# EAGLE design H26R01 (EAGLE 9.6.2)

## Sheet 1 of 2
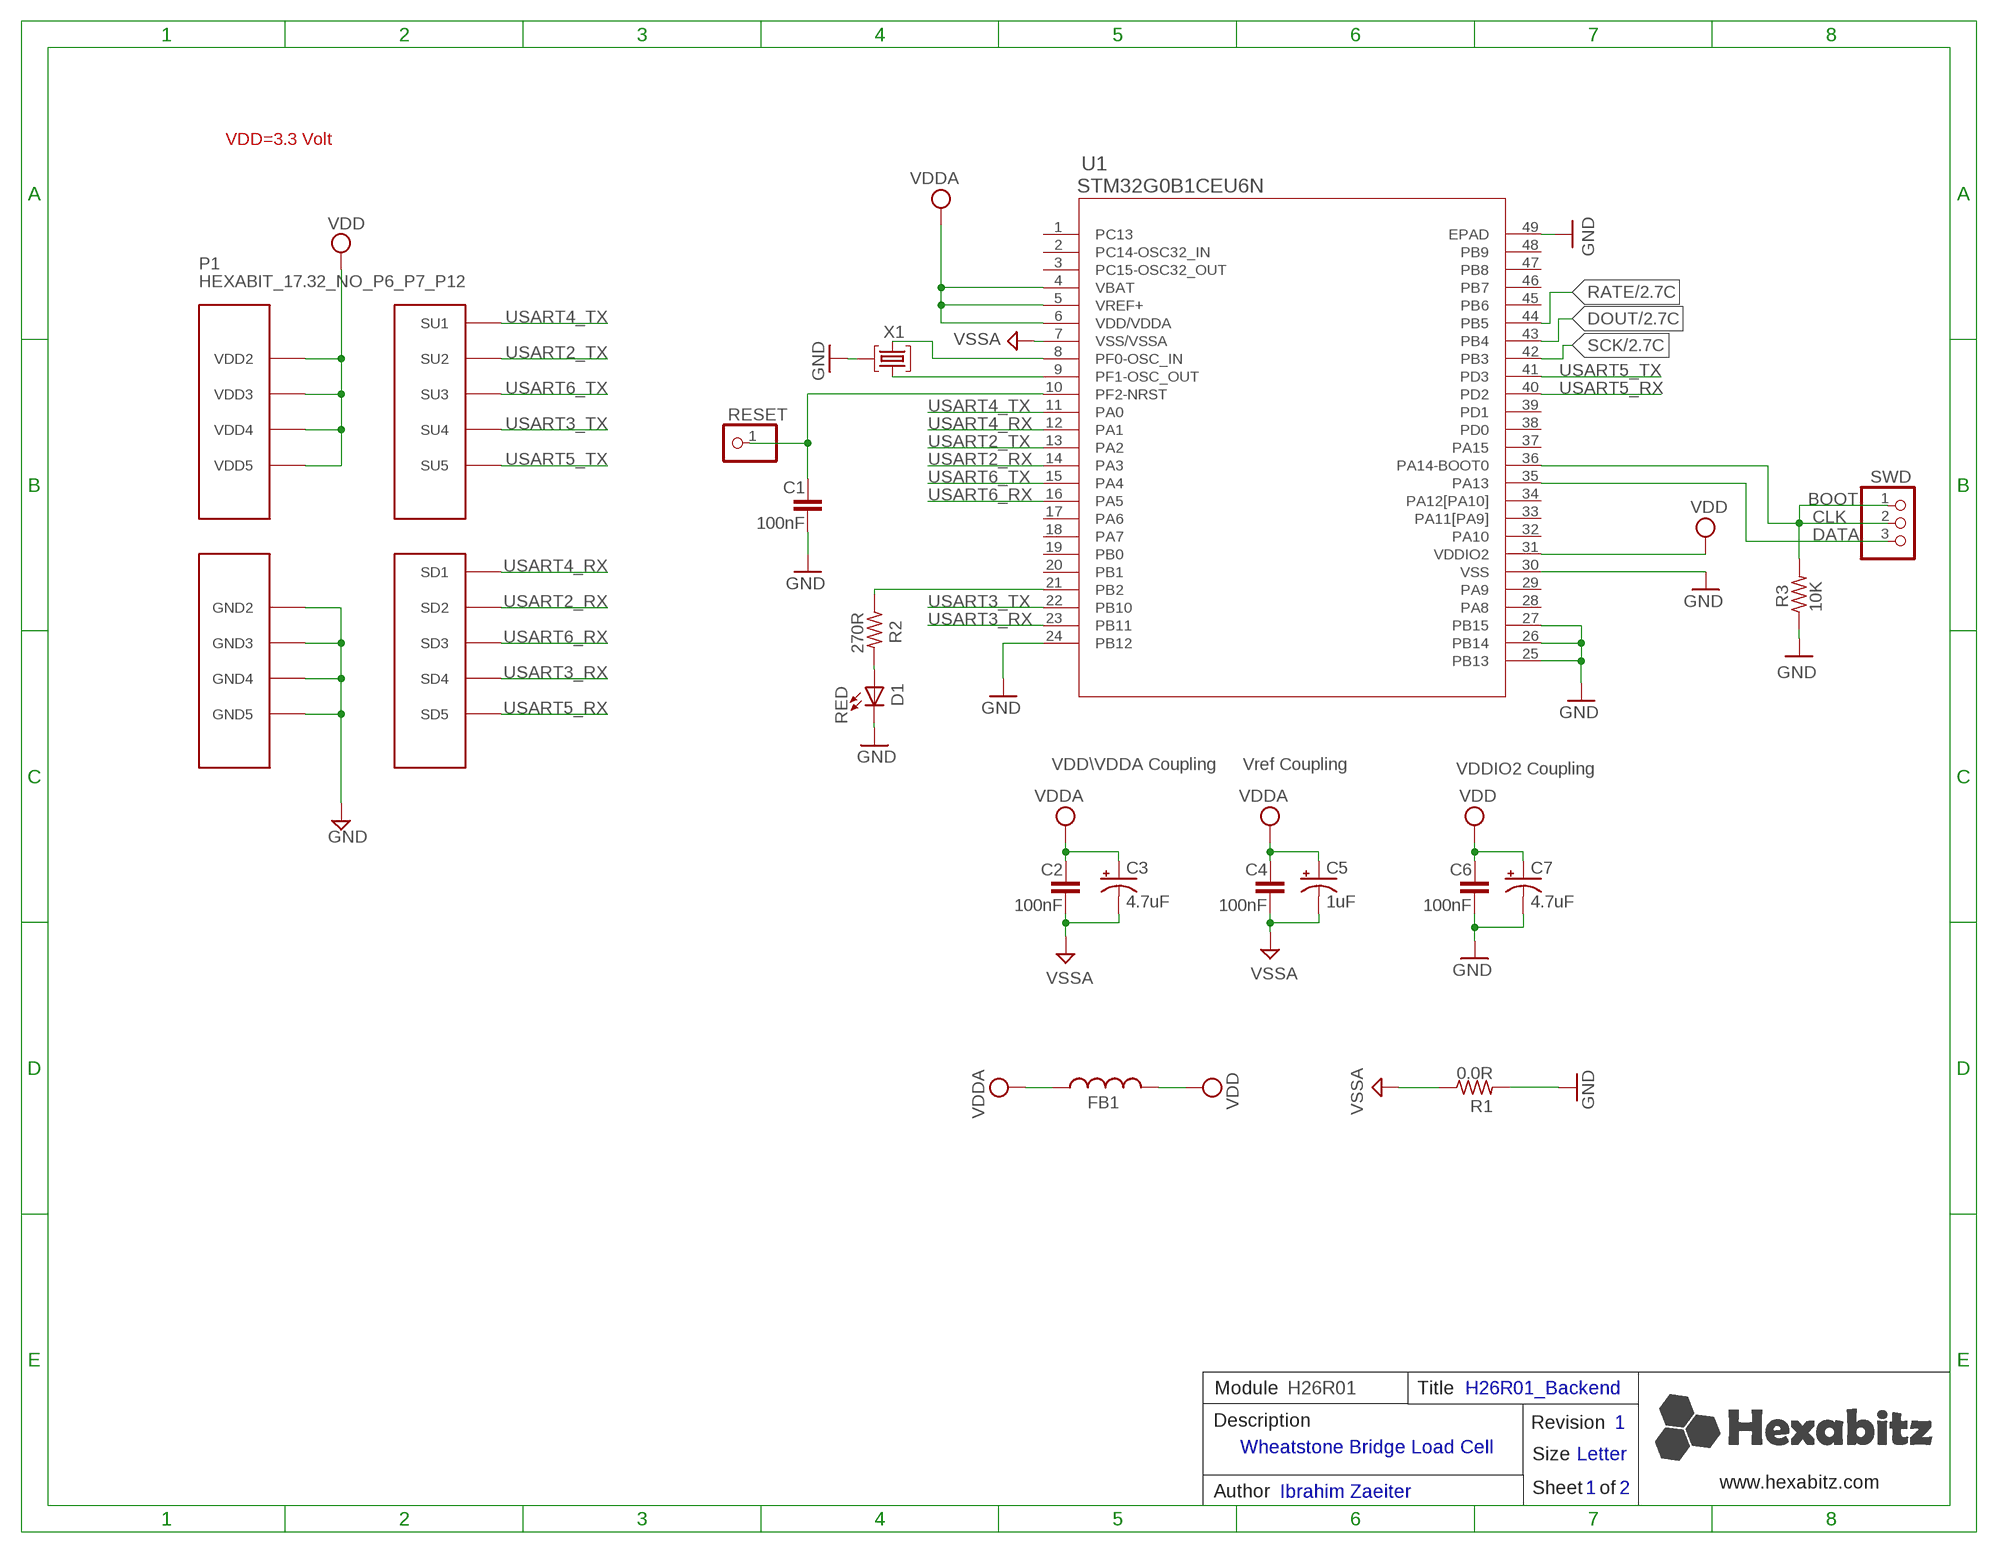
[diagram p0: schematic, sheet 1]

### Parts
C1  100nF  C-0603  [C-0603]
C2  100nF  C-0603  [C-0603]
C3  4.7uF  C-0805-POL  [C-0805-POL]
C4  100nF  C-0603  [C-0603]
C5  1uF  C-0805-POL  [C-0805-POL]
C6  100nF  C-0603  [C-0603]
C7  4.7uF  C-0805-POL  [C-0805-POL]
D1  RED  VLMS1300-GS08  [VLMS1300-GS08]
FB1  FB-0603  [FB-0603]
P1  HEXABIT_17.32_NO_P6_P7_P12  [HEXABIT_17.32_NO_P6_P7_P12]
R1  0.0R  R-0603  [R-0603]
R2  270R  R-0603  [R-0603]
R3  10K  R-0603  [R-0603]
RESET  R  PINHD-1X1  [1X01]
SWD  PINHD-1X3  [1X03]
U1  STM32G0B1CEU6N  [HEXABITZ_ICS_QFN_B1CEU6_STM-L]
X1  XTALL_CSTCE8M00G52  [XTALL_CSTCE8M00G52]

### Nets
CLK: R3.2 SWD.1 SWD.2 U1.36(PA14-BOOT0)
DATA: SWD.3 U1.35(PA13)
DOUT: U1.43(PB4) ; also sheet 2
GND: C1.2 C6.2 C7.2(-) D1.C P1.PAD_PD8(GND2) P1.PAD_PD9(GND3) P1.PAD_PD10(GND4) P1.PAD_PD11(GND5) R1.2 R3.1 U1.24(PB12) U1.25(PB13) U1.26(PB14) U1.27(PB15) U1.30(VSS) U1.49(EPAD) X1.P$2 ; also sheet 2
N$1: D1.A R2.2
N$2: R2.1 U1.21(PB2)
N$5: U1.9(PF1-OSC_OUT) X1.P$1
N$6: U1.8(PF0-OSC_IN) X1.P$3
N$8: C1.1 RESET.1 U1.10(PF2-NRST)
RATE: U1.44(PB5) ; also sheet 2
SCK: U1.42(PB3) ; also sheet 2
USART2_RX: P1.PAD_PD2(SD2) U1.14(PA3)
USART2_TX: P1.PAD_PU2(SU2) U1.13(PA2)
USART3_RX: P1.PAD_PD4(SD4) U1.23(PB11)
USART3_TX: P1.PAD_PU4(SU4) U1.22(PB10)
USART4_RX: P1.PAD_PD1(SD1) U1.12(PA1)
USART4_TX: P1.PAD_PU1(SU1) U1.11(PA0)
USART5_RX: P1.PAD_PD5(SD5) U1.40(PD2)
USART5_TX: P1.PAD_PU5(SU5) U1.41(PD3)
USART6_RX: P1.PAD_PD3(SD3) U1.16(PA5)
USART6_TX: P1.PAD_PU3(SU3) U1.15(PA4)
VDD: C6.1 C7.1(+) FB1.2 P1.PAD_PU8(VDD2) P1.PAD_PU9(VDD3) P1.PAD_PU10(VDD4) P1.PAD_PU11(VDD5) U1.31(VDDIO2) ; also sheet 2
VDDA: C2.1 C3.1(+) C4.1 C5.1(+) FB1.1 U1.4(VBAT) U1.5(VREF+) U1.6(VDD/VDDA) ; also sheet 2
VSSA: C2.2 C3.2(-) C4.2 C5.2(-) R1.1 U1.7(VSS/VSSA) ; also sheet 2
Unconnected: U1.1(PC13) U1.2(PC14-OSC32_IN) U1.3(PC15-OSC32_OUT) U1.17(PA6) U1.18(PA7) U1.19(PB0) U1.20(PB1) U1.28(PA8) U1.29(PA9) U1.32(PA10) U1.33(PA11[PA9]) U1.34(PA12[PA10]) U1.37(PA15) U1.38(PD0) U1.39(PD1) U1.45(PB6) U1.46(PB7) U1.47(PB8) U1.48(PB9)

### Notes on the sheet
- VDD=3.3 Volt
- BOOT
- VDD\VDDA Coupling | Vref Coupling | VDDIO2 Coupling
- Module | H26R01 | Title | H26R01_Backend
- Description | Revision | 1
- Wheatstone Bridge Load Cell
- Size | Letter
- www.hexabitz.com
- Author | Ibrahim Zaeiter | Sheet   of | 1 | 2
- C:/Users/Admin/Desktop/logodraft.bmp

## Sheet 2 of 2
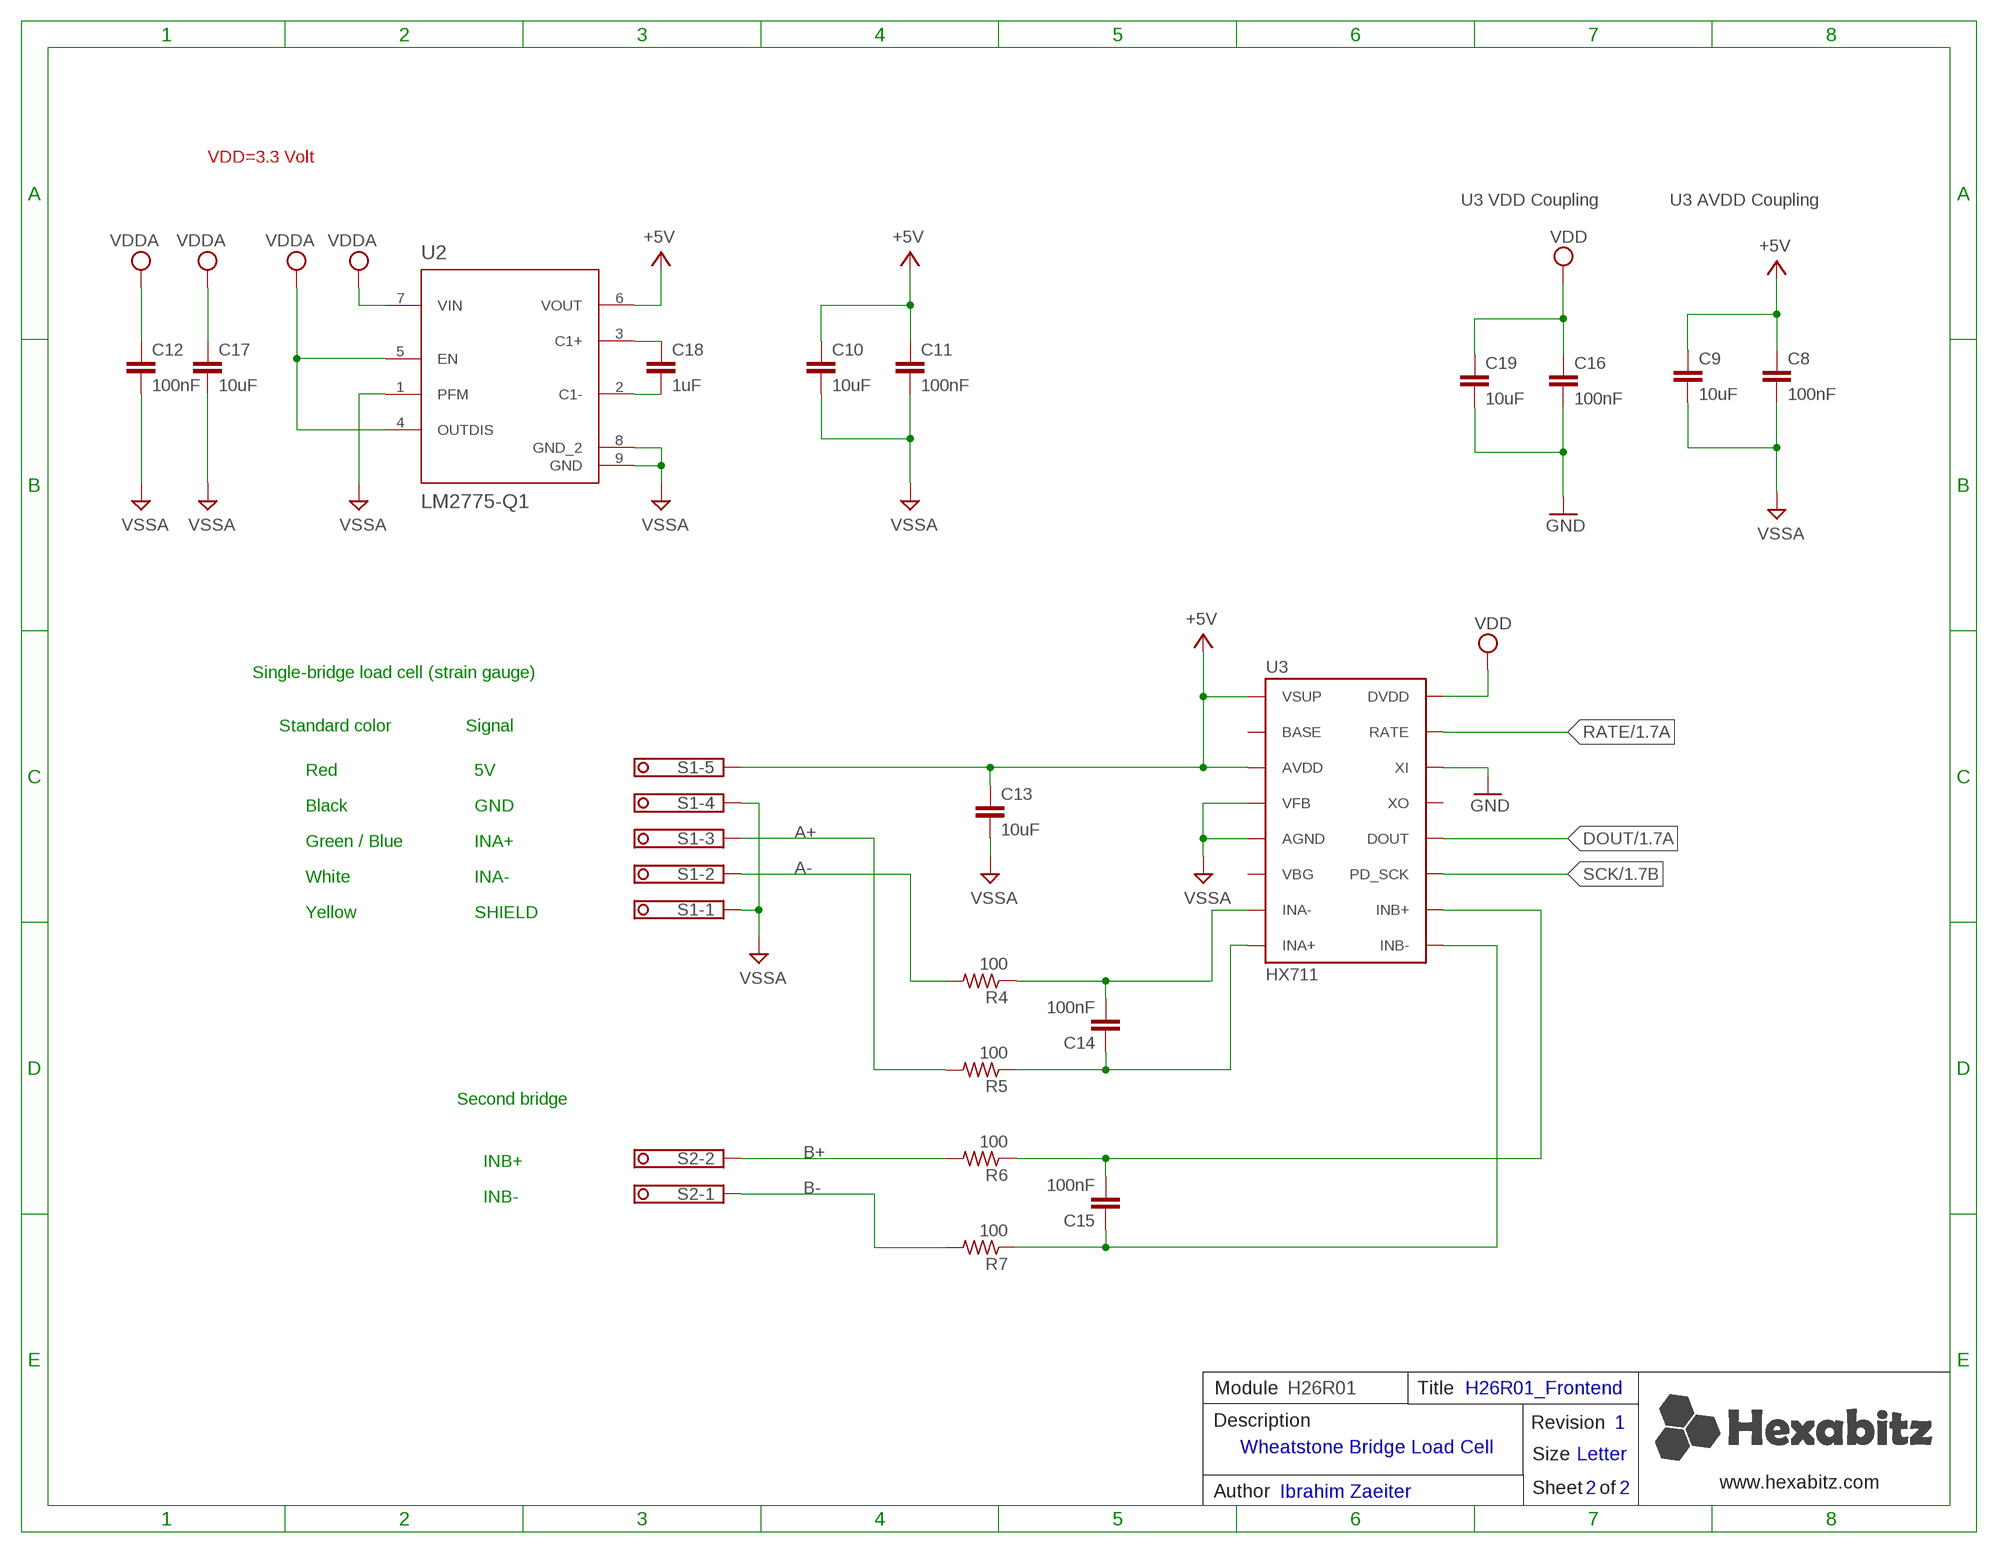
[diagram p1: schematic, sheet 2]

### Parts
C8  100nF  C-0603  [C-0603]
C9  10uF  C-0603  [C-0603]
C10  10uF  C-0603  [C-0603]
C11  100nF  C-0603  [C-0603]
C12  100nF  C-0603  [C-0603]
C13  10uF  C-0603  [C-0603]
C14  100nF  C-0603  [C-0603]
C15  100nF  C-0603  [C-0603]
C16  100nF  C-0603  [C-0603]
C17  10uF  C-0603  [C-0603]
C18  1uF  C-0603  [C-0603]
C19  10uF  C-0603  [C-0603]
R4  100  R-0603  [R-0603]
R5  100  R-0603  [R-0603]
R6  100  R-0603  [R-0603]
R7  100  R-0603  [R-0603]
S1  CON-PHOENIX-350_1751277  [CON-PHOENIX-350_1751277]
S2  CON-PHOENIX-350_1751248  [CON-PHOENIX-350_1751248]
U2  LM2775-Q1  LM2775QDSGRQ1  [DSG0008A]
U3  HX711  [HX711_SO16]

### Nets
+5V: C8.1 C9.1 C10.1 C11.1 C13.1 S1.5 U2.6(VOUT) U3.1(VSUP) U3.3(AVDD)
A+: R5.2 S1.3
A-: R4.2 S1.2
B+: R6.2 S2.2
B-: R7.2 S2.1
DOUT: U3.12(DOUT) ; also sheet 1
GND: C16.2 C19.2 U3.14(XI) ; also sheet 1
INA+: C14.1 R5.1 U3.8(INA+)
INA-: C14.2 R4.1 U3.7(INA-)
INB+: C15.2 R6.1 U3.10(INB+)
INB-: C15.1 R7.1 U3.9(INB-)
N$3: C18.1 U2.3(C1+)
N$13: C18.2 U2.2(C1-)
RATE: U3.15(RATE) ; also sheet 1
SCK: U3.11(PD_SCK) ; also sheet 1
VDD: C16.1 C19.1 U3.16(DVDD) ; also sheet 1
VDDA: C12.1 C17.1 U2.4(OUTDIS) U2.5(EN) U2.7(VIN) ; also sheet 1
VSSA: C8.2 C9.2 C10.2 C11.2 C12.2 C13.2 C17.2 S1.1 S1.4 U2.1(PFM) U2.8(GND_2) U2.9(GND) U3.4(VFB) U3.5(AGND) ; also sheet 1
Unconnected: U3.2(BASE) U3.6(VBG) U3.13(XO)

### Notes on the sheet
- VDD=3.3 Volt
- U3 VDD Coupling | U3 AVDD Coupling
- Single-bridge load cell (strain gauge)
- Standard color | Signal
- Red | 5V
- Black | GND
- Green / Blue | INA+
- White | INA-
- Yellow | SHIELD
- Second bridge
- INB+
- INB-
- Module | H26R01 | Title | H26R01_Frontend
- Description | Revision | 1
- Wheatstone Bridge Load Cell
- Size | Letter
- www.hexabitz.com
- Author | Ibrahim Zaeiter | Sheet   of | 2 | 2

## Library data of the parts
C1 C2 C4 C6 = HEXABITZ_RCLS:C-0603: CAP CER 10% X7R 0603
C3 C5 C7 = HEXABITZ_RCLS:C-0805-POL: Cap Tant Solid SMD 2012
C8 C11 C12 C16 = HEXABITZ_RCLS:C-0603: CAP CER 10% X7R 0603; CAPACITANCE: 100nF; MFN: KEMET; MPN: C0603C104K8RACTU; OCTOPART_URL: https://octopart.com/c0603c104k8ractu-kemet-145075?r=sp&s=9bS9ASSwSEqMCE9KBEQZ0g; TOLERANCE: 10%; VOLTAGE_RATING: 10V
C9 C10 C17 C19 = HEXABITZ_RCLS:C-0603: CAP CER 10% X7R 0603; CAPACITANCE: 10uF; MFN: Murarta; MPN: GRM188R61A106KE69D; OCTOPART_URL: https://octopart.com/grm188r61a106ke69d-murata-22851381?r=ap&s=o9t4ILLiSny6rfdd0oM5Kg; TOLERANCE: 10%; VOLTAGE_RATING: 10V
C13 = HEXABITZ_RCLS:C-0603: CAP CER 10% X7R 0603; CAPACITANCE: 10uF; MFN: Murata; MPN: GRM188R61A106KE69D; OCTOPART_URL: https://octopart.com/grm188r61a106ke69d-murata-22851381?r=ap&s=o9t4ILLiSny6rfdd0oM5Kg; TOLERANCE: 10%; VOLTAGE_RATING: 10V
C14 C15 = HEXABITZ_RCLS:C-0603: CAP CER 10% X7R 0603; CAPACITANCE: 100nF; MFN: KEMET; MPN: C0603C104K8RACTU; OCTOPART_URL: https://octopart.com/c0603c104k8ractu-kemet-145075?r=sp&s=9bS9ASSwSEqMCE9KBEQZ0g; TOLERANCE: 10V; VOLTAGE_RATING: 10%
C18 = HEXABITZ_RCLS:C-0603: CAP CER 10% X7R 0603; CAPACITANCE: 1uF; MFN: Murarta; MPN: GRM188R61A105KA61J; OCTOPART_URL: https://octopart.com/grm188r61a105ka61j-murata-9221870?r=sp&s=wvtiDxTpS1CkWsFaa2pliQ; TOLERANCE: 10%; VOLTAGE_RATING: 10V
D1 = Hexabitz:VLMS1300-GS08: Red 0603 130° Clear 54 mcd 2 V Surface Mount ChipLED ; Octopart Url : http://octopart.com/vlms1300-gs08-vishay-21709201; MFN: Vishay; MPN: VLMS1300-GS08; OCTOPART_URL: https://octopart.com/vlms1300-gs08-vishay-21709201?r=sp&s=_gcP4_q8T1SC6PJQPTQ9yA
FB1 = HEXABITZ_RCLS:FB-0603: Ferrite Beads Multi-Layer 0603
P1 = hexabitz_connectors:HEXABIT_?_NO_P6_P7_P12: Hexabitz Hexagon Module Connector Hexagon side length = 17.32mm. The following ports are removed: P6 P7 P12
R1-R3 = HEXABITZ_RCLS:R-0603: Thick Film Resistors - SMD 0603
R4-R7 = HEXABITZ_RCLS:R-0603: Thick Film Resistors - SMD 0603; MFN: Yageo; MPN: RC0603JR-07100RL; OCTOPART_URL: https://octopart.com/rc0603jr-07100rl-yageo-55458504?r=sp&s=j3XfnGiETZqzM9npqpV08Q; RESISTANCE: 100; TOLERANCE: 5%
RESET = HEXABITZ_USER_INTERFACE_PARTS:PINHD-1X1: PIN HEADER; MFN: TE Connectivity; MPN: 87227-1; OCTOPART_URL: https://octopart.com/87227-1-te+connectivity-39512052?r=sp
S1 = Hexabitz:CON-PHOENIX-350_1751277: MKDS 1/ 5-3,5 Printklemme Nennstrom: 10 A Bemessungsspannung: 160 V Raster: 3,5 mm Polzahl: 5 Montageart: Löten Anschlussart: Schraubanschluss Anschlussrichtung vom Leiter zur Platine: 0° Source: http://eshop.phoenixcontact.com .. 1751277.pdf; MFN: Phoenix Contact; MPN: 1984646; OCTOPART_URL: https://octopart.com/1984646-phoenix+contact-50274?r=sp&s=drI_GVM4QHaL48lSCATrxQ; OC_FARNELL: unknown; OC_NEWARK: unknown
S2 = HEXABITZ_CONNECTION_PARTS:CON-PHOENIX-350_1751248: 2pin Terminal Block; Printed Circuit; 10 A; 160 V; 3.5 mm; 2; 3.5 mm; 1.2 mm; M2; PA; MFN: Phoenix Contact; MPN: 1984617; OCTOPART_URL: https://octopart.com/1984617-phoenix+contact-58834?r=sp&s=Ef_UaV1JSFmY0wggQyN1Mw; OC_FARNELL: unknown; OC_NEWARK: unknown
SWD = pinhead:PINHD-1X3: PIN HEADER
U1 = HEXABITZ_ICs:STM32G0B1CEU6N
U2 = HEXABITZ_ICs:LM2775QDSGRQ1: Switched Capacitor 5V Boost Converter 8-WSON -40 to 125; MANUFACTURER: Texas Instruments; MFN: Texas Instruments; MPN: LM2775QDSGRQ1; OCTOPART_URL: https://octopart.com/lm2775qdsgrq1-texas+instruments-93339195?r=sp&s=OA7oim0HQqaBsU4tLKFWXg LM2775QDSGRQ1; PARTNUMBER: LM2775QDSGRQ1; REFDES: RefDes; TYPE: TYPE
U3 = HEXABITZ_ICs:HX711: Load Cell Amplifier; MFN: Avia Semiconductor; MPN: HX711
X1 = Hexabitz:XTALL_CSTCE8M00G52: MURATA CSTCE8M00G52-R0 RESONATOR, SMD, 8MHZ ; Octopart Url : https://octopart.com/cstce8m00g52-r0-murata-7145559; MFN: Murata; MPN: CSTCE8M00G52Z-R0; OCTOPART_URL: https://octopart.com/cstce8m00g52z-r0-murata-17755941?r=sp&s=JDnNJnrHQhyS8Zk4ofFWXw

## Board
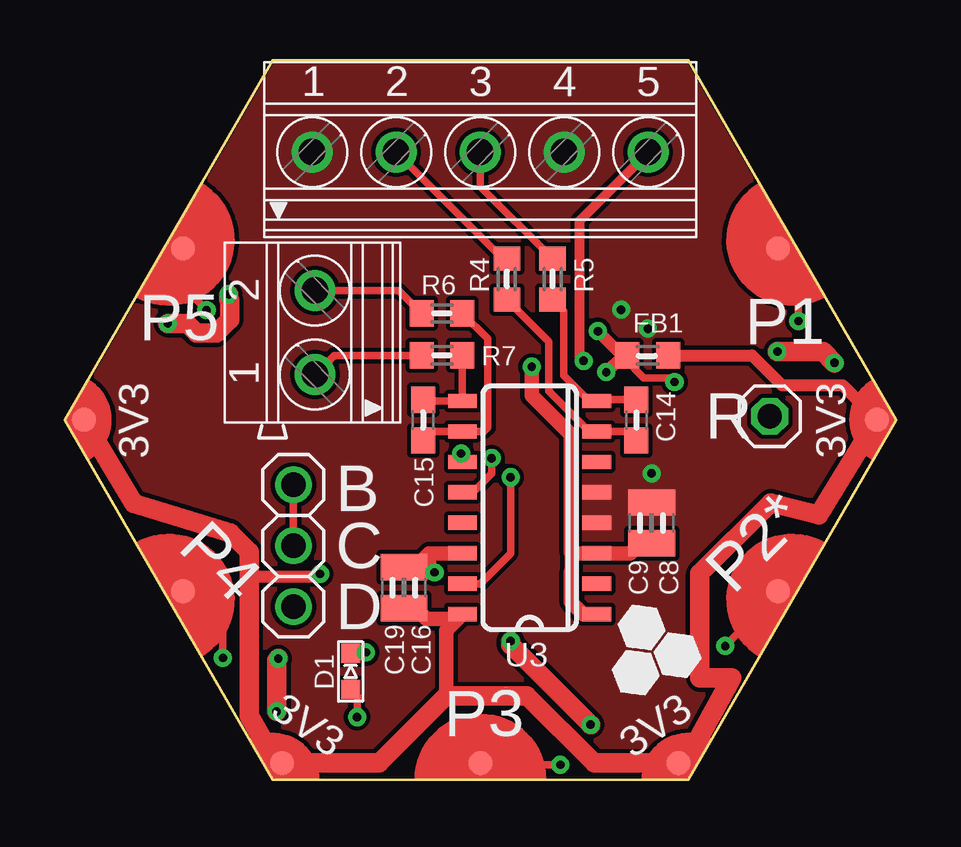
[diagram p2: board, top side]
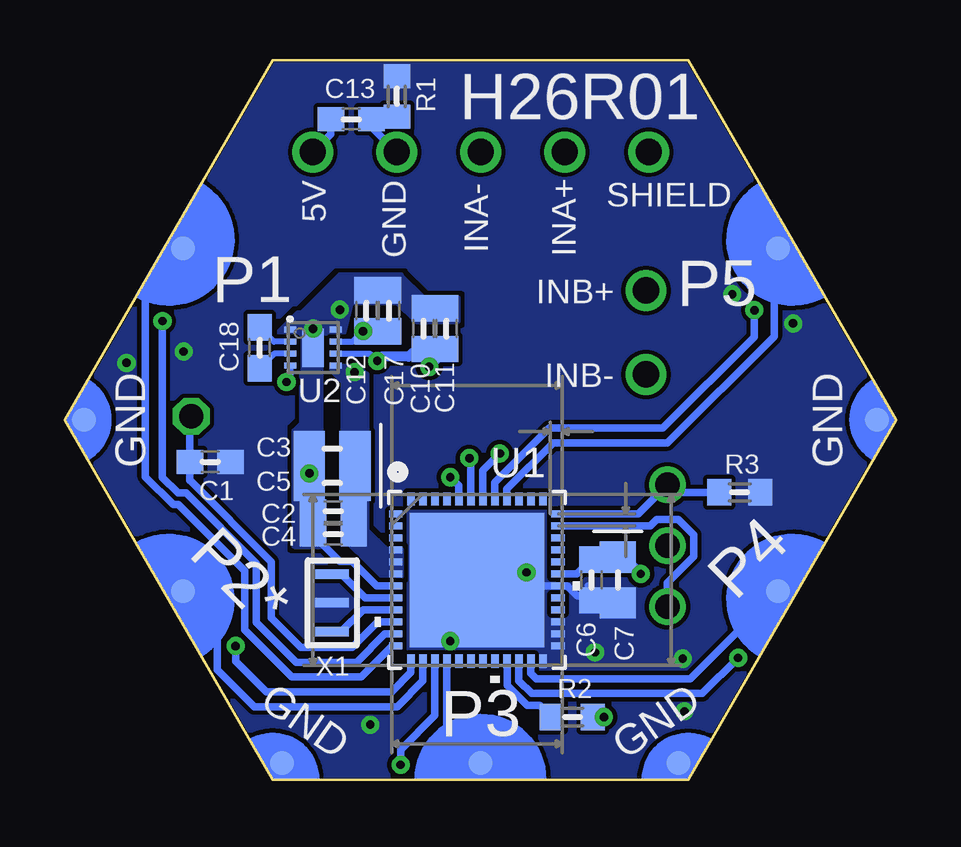
[diagram p3: board, bottom side, seen from below]

Size 34.64 x 30 mm. Coordinates in mm from the lower left corner, seen from the top.
Copper layers (1*16): Top 0.035mm / dielectric 1.5mm / Bottom 0.035mm
Design rules "2_layer *": minimum track width 7mil, minimum drill 10mil, track to track 7mil, track to pad 7mil, pad to pad 7mil, via to via 7mil, smd to smd 0mil, copper to edge 1mil, drill to drill 8mil, minimum pad ring 10mil, minimum via ring 8mil, stop-mask expansion 2mil, vias tented up to drill 15mil, thermal gap 10mil

### Footprints (pad centres in the part's own frame; a part is rotated, then mirrored left to right if it is on the bottom)
C-0603 = smd 1.1 x 1: 1 -0.85,0; 2 0.85,0
C-0805-POL = smd 1.3 x 1.5: 1 -0.95,0; 2 0.95,0
VLMS1300-GS08 = smd 0.8 x 0.8: A 0,0.75; C 0,-0.75
FB-0603 = smd 1 x 1.1: 1 -0.85,0; 2 0.85,0
HEXABIT_17.32_NO_P6_P7_P12 = smd 1 x 1 bottom: PAD_PD1 12.39,7.15; PAD_PD2 12.39,-7.15; PAD_PD3 0,-14.31; PAD_PD4 -12.39,-7.15; PAD_PD5 -12.39,7.15; PAD_PD8 16.52,0; PAD_PD9 8.26,-14.31; PAD_PD10 -8.26,-14.31; PAD_PD11 -16.52,0 | smd 1 x 1: PAD_PU1 12.39,7.15; PAD_PU2 12.39,-7.15; PAD_PU3 0,-14.31; PAD_PU4 -12.39,-7.15; PAD_PU5 -12.39,7.15; PAD_PU8 16.52,0; PAD_PU9 8.26,-14.31; PAD_PU10 -8.26,-14.31; PAD_PU11 -16.52,0
R-0603 = smd 1 x 1.1: 1 -0.85,0; 2 0.85,0
1X01 = drill 1.016 octagon: 1 0,0
CON-PHOENIX-350_1751277 = drill 1.1 pad 1.7: 1 -7,-0.1; 2 -3.5,-0.1; 3 0,-0.1; 4 3.5,-0.1; 5 7,-0.1
CON-PHOENIX-350_1751248 = drill 1.1 pad 1.7: 1 -1.75,-0.1; 2 1.75,-0.1
1X03 = drill 1.016: 1 -2.54,0; 2 0,0; 3 2.54,0
HEXABITZ_ICS_QFN_B1CEU6_STM-L = smd 0.55 x 0.3: 1 -3.38,2.751; 2 -3.38,2.251; 3 -3.38,1.75; 4 -3.38,1.25; 5 -3.38,0.75; 6 -3.38,0.25; 7 -3.38,-0.25; 8 -3.38,-0.75; 9 -3.38,-1.25; 10 -3.38,-1.75; 11 -3.38,-2.251; 12 -3.38,-2.751; 25 3.38,-2.751; 26 3.38,-2.251; 27 3.38,-1.75; 28 3.38,-1.25; 29 3.38,-0.75; 30 3.38,-0.25; 31 3.38,0.25; 32 3.38,0.75; 33 3.38,1.25; 34 3.38,1.75; 35 3.38,2.251; 36 3.38,2.751 | smd 0.3 x 0.55: 13 -2.751,-3.38; 14 -2.251,-3.38; 15 -1.75,-3.38; 16 -1.25,-3.38; 17 -0.75,-3.38; 18 -0.25,-3.38; 19 0.25,-3.38; 20 0.75,-3.38; 21 1.25,-3.38; 22 1.75,-3.38; 23 2.251,-3.38; 24 2.751,-3.38; 37 2.751,3.38; 38 2.251,3.38; 39 1.75,3.38; 40 1.25,3.38; 41 0.75,3.38; 42 0.25,3.38; 43 -0.25,3.38; 44 -0.75,3.38; 45 -1.25,3.38; 46 -1.75,3.38; 47 -2.251,3.38; 48 -2.751,3.38 | smd 5.6 x 5.6: 49 0,0
DSG0008A = smd 0.5 x 0.25: 1 -0.95,0.75; 2 -0.95,0.25; 3 -0.95,-0.25; 4 -0.95,-0.75; 5 0.95,-0.75; 6 0.95,-0.25; 7 0.95,0.25; 8 0.95,0.75 | smd 0.9 x 1.6: 9 0,0
HX711_SO16 = smd 0.6 x 1.2: 1 -4.445,-2.8; 2 -3.175,-2.8; 3 -1.905,-2.8; 4 -0.635,-2.8; 5 0.635,-2.8; 6 1.905,-2.8; 7 3.175,-2.8; 8 4.445,-2.8; 9 4.445,2.8; 10 3.175,2.8; 11 1.905,2.8; 12 0.635,2.8; 13 -0.635,2.8; 14 -1.905,2.8; 15 -3.175,2.8; 16 -4.445,2.8
XTALL_CSTCE8M00G52 = smd 1.4 x 0.4: P$1 0,1.2; P$2 0,0; P$3 0,-1.2

### Placement (x,y rotation side)
C1  28.58,13.24 0 bottom
C2  23.45,11.18 180 bottom
C3  23.5,13.78 180 bottom
C4  23.45,10.22 180 bottom
C5  23.5,12.36 180 bottom
C6  12.7,8.32 270 bottom
C7  11.59,8.32 270 bottom
C8  24.93,10.7 90 top
C9  23.97,10.7 90 top
C10  19.69,18.8 90 bottom
C11  18.74,18.8 90 bottom
C12  22.07,19.54 90 bottom
C13  22.7,27.53 0 bottom
C14  23.82,14.99 270 top
C15  14.93,14.99 270 top
C16  14.61,8 90 top
C17  21.12,19.54 90 bottom
C18  26.51,18 90 bottom
C19  13.66,8 90 top
D1  11.91,4.51 180 top
FB1  24.29,17.69 0 top
P1  17.32,15 0 top
R1  20.8,28.48 90 bottom
R2  13.5,2.6 0 bottom
R3  6.51,11.97 180 bottom
R4  18.42,20.86 90 top
R5  20.32,20.86 90 top
R6  15.72,19.43 180 top
R7  15.72,17.69 180 top
RESET  29.37,15.15 0 top
S1  17.31,26.26 0 top
S2  10.32,18.64 90 top
SWD  9.53,9.75 270 top
U1  17.47,8.32 0 bottom
U2  24.29,18 0 bottom
U3  19.37,11.34 90 top
X1  23.5,7.37 180 bottom

### Tracks (layer width: path | path; a pad name or v marks a point on that pad's centre or on a via)
+5V  (via drill 0.35)
  Top 0.406: S1.5 21.45,23.3 21.45,17.63 v21.62,17.46
  Top 0.61: C8.1 C9.1 23.55,9.43 U3.3 21.12,9.43 | v19.46,17.21 19.46,16.01 21.09,14.38 21.09,9.46 21.12,9.43 | U3.1 21.59,6.89 21.09,7.4 21.09,8.66 21.12,8.69 21.12,9.43
  Bottom 0.254: U2.6 21.92,17.75 v21.62,17.46
  Bottom 0.305: C13.1 23.55,26.91 S1.5
  Bottom 0.406: v21.62,17.46 21.45,17.63 20.32,17.63 20.16,17.79 19.85,17.79 C10.1 C11.1 19.46,17.23 v19.46,17.21
A+
  Top 0.305: S1.3 17.31,24.73 R5.2
A-
  Top 0.305: S1.2 18.26,21.71 R4.2
B+
  Top 0.305: S2.2 13.91,20.39 R6.2
B-
  Top 0.305: S2.1 11.22,17.69 R7.2
CLK
  Top 0.305: SWD.1 SWD.2
  Bottom 0.305: U1.36 10.75,11.07 SWD.1 9.21,11.97 R3.2
DATA
  Bottom 0.305: U1.35 10.25,10.57 9.98,10.84 9.08,10.84 8.44,10.2 8.44,9.3 9.53,8.2 SWD.3
DOUT  (via drill 0.35)
  Top 0.305: U3.12 16.99,11.97 17.78,12.77 v17.78,13.4
  Bottom 0.305: U1.43 17.72,13.33 v17.78,13.4
GND  (via drill 0.35)
  Top 0.305: D1.C 11.95,5.3 v12.54,5.3
  Top 0.61: C19.2 C16.2 15.19,9.43 | U3.14 15.19,9.43 | 15.19,9.43 15.19,8.85 v15.4,8.64
  Top 0.813: v8.89,5.04 8.83,4.98 v8.83,2.84 | v32.07,17.37 31.59,17.85 v29.69,17.85 | v21.91,2.29 18.58,5.62 v18.58,5.77 | v4.29,19.01 5.1,19.01 5.51,18.61 6.3,18.61 6.87,19.17 6.87,19.97 6.83,20 v6.83,20.23
  Bottom 0.305: 12.83,8.07 12.41,7.66 12.89,7.66 | 12.89,7.66 C6.2 11.69,7.47 C7.2 | 12.89,7.66 13.28,7.66 13.69,8.07 U1.30 17.22,8.07 U1.49
  Bottom 0.406: U1.49 17.47,6.57 17.78,6.26
  pour Bottom (rank 2, no thermals): 8.5,-0.16 25.82,-0.16 34.48,14.84 25.82,29.84 8.5,29.84 -0.16,14.84
INA+
  Top 0.305: R5.1 20.8,19.54 20.8,16.84 21.85,15.78 U3.8 22.23,15.84 C14.1
INA-
  Top 0.305: R4.1 20.16,18.27 20.16,16.2 21.85,14.51 U3.7 23.44,14.51 C14.2
INB+
  Top 0.305: R6.1 17.63,18.38 17.63,14.67 17.47,14.51 U3.10 15.3,14.51 C15.2
INB-
  Top 0.305: R7.1 U3.9 14.98,15.78 C15.1
N$1  (via drill 0.35)
  Top 0.305: v12.18,2.61 12.18,3.49 D1.A
  Bottom 0.305: R2.2 v12.18,2.61
N$2
  Bottom 0.305: R2.1 14.85,3.1 15.38,3.1 16.2,3.92 16.2,4.92 U1.21
N$3
  Bottom 0.254: U2.3 25.92,17.75 C18.1
N$5
  Bottom 0.305: X1.P$1 23.11,6.17 22.21,7.07 U1.9
N$6
  Bottom 0.305: X1.P$3 23.11,8.57 22.11,7.57 U1.8
N$8
  Bottom 0.305: U1.10 21.61,6.57 22.67,5.5 24.8,5.5 26.04,6.74 26.04,9.08 29.42,12.46 29.43,12.48 C1.1 29.43,15.09 RESET.1
N$13
  Bottom 0.254: U2.2 25.91,18.25 C18.2
RATE  (via drill 0.35)
  Top 0.305: U3.15 17.31,8.16 18.58,9.43 v18.58,12.61
  Bottom 0.305: v18.58,12.61 18.28,12.31 18.26,12.31 18.22,12.26 U1.44
SCK  (via drill 0.35)
  Top 0.305: U3.11 16.57,13.54 v16.51,13.6
  Bottom 0.305: U1.42 17.22,12.89 v16.51,13.6
USART2_RX
  Bottom 0.305: P1.PAD_PD2 28.28,6.42 28.28,4.57 26.75,3.04 20.78,3.04 19.72,4.11 U1.14
USART2_TX  (via drill 0.35)
  Top 0.305: P1.PAD_PU2 29.71,7.76 v27.52,5.57
  Bottom 0.305: U1.13 20.22,4.46 21.02,3.66 26.24,3.66 27.52,4.93 v27.52,5.57
USART3_RX
  Bottom 0.305: U1.23 15.22,4.43 14.99,4.2 8.58,4.2 P1.PAD_PD4
USART3_TX  (via drill 0.35)
  Top 0.305: v6.58,5.07 6.58,6.2 P1.PAD_PU4
  Bottom 0.305: U1.22 15.72,4.12 15.18,3.59 8.07,3.59 v6.58,5.07
USART4_RX
  Bottom 0.305: U1.12 21,5.57 22.29,4.27 25.18,4.27 27.15,6.24 27.15,8.7 29.91,11.46 30.12,11.46 31.28,12.62 31.28,20.37 30.99,20.88 P1.PAD_PD1
USART4_TX  (via drill 0.35)
  Top 0.305: v30.57,19.12 30.57,21.29 P1.PAD_PU1
  Bottom 0.305: U1.11 21.3,6.07 22.48,4.89 24.99,4.89 26.65,6.55 26.65,9.01 29.58,11.94 29.92,11.94 30.57,12.59 v30.57,19.12
USART5_RX
  Bottom 0.305: U1.40 16.22,12.11 14.29,14.04 9.53,14.04 5.09,18.48 5.09,21.99 P1.PAD_PD5
USART5_TX  (via drill 0.35)
  Top 0.305: v5.91,19.57 4.93,20.54 P1.PAD_PU5
  Bottom 0.305: v5.91,19.57 5.91,18.46 9.72,14.65 14.46,14.65 16.72,12.39 U1.41
USART6_RX
  Bottom 0.305: U1.16 18.72,0.98 18.43,0.69 P1.PAD_PD3
USART6_TX  (via drill 0.35)
  Top 0.305: v20.65,0.61 17.4,0.61 P1.PAD_PU3
  Bottom 0.305: U1.15 19.22,2.68 20.65,1.25 v20.65,0.61
VDD  (via drill 0.35)
  Top 0.508: 7.68,8.48 10.55,8.48 v10.64,8.57 | FB1.2 28.64,17.69 29.89,16.43 32.41,16.43 P1.PAD_PU8
  Top 0.61: U3.16 16.38,6.7 | 16.38,6.7 15.89,6.21 15.89,3.49 | C19.1 C16.1 15.06,6.7 16.38,6.7
  Top 0.813: P1.PAD_PU11 2.88,11.51 6.89,10.28 7.68,9.49 7.68,8.48 7.68,2.66 8.49,1.26 P1.PAD_PU10 13.09,0.69 15.89,3.49 19.26,3.49 22.05,0.69 P1.PAD_PU9 26.18,1.29 27.79,4.24 26.47,4.24 26.47,8.59 29.42,11.54 31.42,11.04 P1.PAD_PU8
  Bottom 0.305: U1.31 13.3,8.57 C6.1 12.6,9.27 C7.1
  Bottom 0.406: C7.1 11.34,9.27 v10.64,8.57
VDDA  (via drill 0.35)
  Top 0.305: v25.4,16.58 25.25,16.73 24.13,16.73 23.3,17.56
  Top 0.406: 23.3,17.56 23.22,17.64
  Top 0.508: v22.56,16.98 23.22,17.64 | 23.3,17.56 23.42,17.69 | 23.42,17.69 FB1.1 | v22.21,18.69 23.22,17.69 23.42,17.69
  Bottom 0.254: U2.4 25.24,16.74 v25.4,16.58 | U2.7 22.65,18.25 v22.21,18.69 C12.1
  Bottom 0.61: v22.21,18.69 C17.1
  pour Bottom (no thermals): 20.64,8.48 21.43,8.48 23.02,10.07 23.02,16.57 23.5,17.05 23.5,17.21 22.39,17.21 22.07,16.89 22.07,10.38 21.28,9.59 20.64,9.59
VSSA  (via drill 0.35)
  Bottom 0.305: S1.4 21.86,27.21 C13.2 21.75,27.63 R1.1 | C4.2 23.17,9.1 22.66,9.1 21.63,8.07 U1.7
  other vias: 24.29,18.8 24.45,12.76 23.18,19.59
  pour Top (no thermals): 8.82,0 26.14,0 34.8,15 26.14,30 8.82,30 0.16,15
  pour Bottom (no thermals): 25.09,9.75 23.97,9.75 23.97,18.64 23.02,18.64 22.7,19.91 20.8,19.91 20.01,19.11 18.26,19.11 18.26,20.07 19.69,20.07 20.64,21.02 23.18,21.02 24.77,19.43 24.93,19.43 25.72,18.64 24.77,18.64 24.77,14.83 25.09,14.51

### Text on the board
tPlace: P5 | P1 | 3V3 | 3V3 | P2* | P4 | P3 | 3V3 | 3V3
bPlace: H26R01 | P5 | P1 | GND | GND | P4 | P2* | GND | P3 | GND
tNames: R | B | C | D
bNames: GND | 5V | SHIELD | INA+ | INA- | INB+ | INB-